# Altium schematic sheet placaOscilador_TP1_ASSD.SchDoc
size A4
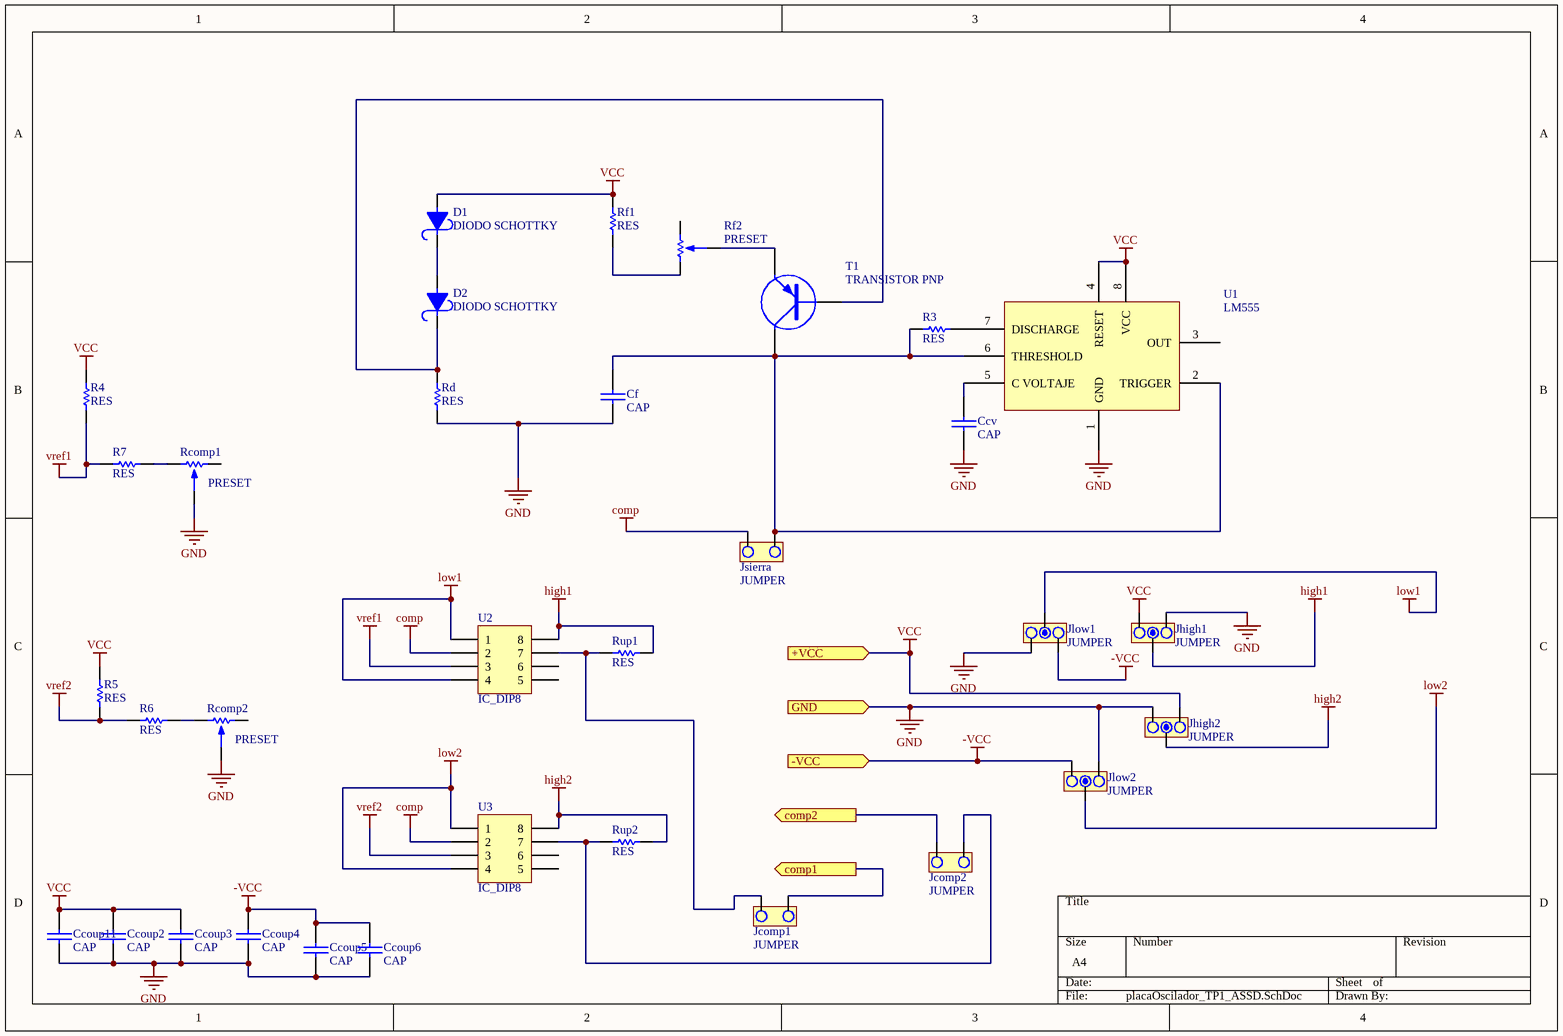
[diagram p0: placaOscilador_TP1_ASSD.SchDoc]

## Parts
Ccoup2  CAP  [CAP200]
Ccoup3  CAP  [CAP200]
Ccoup4  CAP  [CAP200]
Ccoup5  CAP  [CAP200]
Ccoup6  CAP  [CAP200]
Ccoup11  CAP  [CAP200]
Ccv  CAP  [CAP200]
Cf  CAP  [CAP200]
D1  DIODO SCHOTTKY  [DO41]
D2  DIODO SCHOTTKY  [DO41]
Jcomp1  JUMPER  [JUMPER2]
Jcomp2  JUMPER  [JUMPER2]
Jhigh1  JUMPER  [JUMPER3]
Jhigh2  JUMPER  [JUMPER3]
Jlow1  JUMPER  [JUMPER3]
Jlow2  JUMPER  [JUMPER3]
Jsierra  JUMPER  [JUMPER2]
R3  RES  [RES300]
R4  RES  [RES300]
R5  RES  [RES300]
R6  RES  [RES300]
R7  RES  [RES300]
Rcomp1  PRESET  [PRESET V]
Rcomp2  PRESET  [PRESET V]
Rd  RES  [RES300]
Rf1  RES  [RES300]
Rf2  PRESET  [PRESET V]
Rup1  RES  [RES300]
Rup2  RES  [RES300]
T1  TRANSISTOR PNP  [TO92]
U1  LM555  [DIP8]
U2  IC_DIP8  [DIP8]
U3  IC_DIP8  [DIP8]

## Ports
+VCC (in), -VCC (in), comp1 (out), comp2 (out), GND (in)

## Nets
-VCC: Ccoup4.1 Ccoup5.1 Ccoup6.1 Jlow1.1 Jlow2.1 ; port -VCC
comp: Jsierra.1 U2.2 U3.2
GND: Ccoup2.2 Ccoup3.2 Ccoup4.2 Ccoup5.2 Ccoup6.2 Ccoup11.2 Ccv.2 Cf.2 Jhigh1.3 Jhigh2.1 Jlow1.3 Jlow2.3 Rcomp1.2 Rcomp2.2 Rd.1 U1.1(GND) ; port GND
high1: Jhigh1.2 Rup1.2 U2.8
high2: Jhigh2.2 Rup2.2 U3.8
low1: Jlow1.2 U2.1 U2.4
low2: Jlow2.2 U3.1 U3.4
VCC: Ccoup2.1 Ccoup3.1 Ccoup11.1 D1.1 Jhigh1.1 Jhigh2.3 R4.2 R5.2 Rf1.2 U1.4(RESET) U1.8(VCC) ; port +VCC
vref1: R4.1 R7.1 U2.3
vref2: R5.1 R6.1 U3.3
comp1: Jcomp1.2 ; port comp1
comp2: Jcomp2.1 ; port comp2
NetCcv_1: Ccv.1 U1.5(C_VOLTAJE)
NetCf_1: Cf.1 Jsierra.2 R3.1 T1.2(C) U1.2(TRIGGER) U1.6(THRESHOLD)
NetD1_2: D1.2 D2.1
NetD2_2: D2.2 Rd.2 T1.1(B)
NetJcomp1_1: Jcomp1.1 Rup1.1 U2.7
NetJcomp2_2: Jcomp2.2 Rup2.1 U3.7
NetR3_2: R3.2 U1.7(DISCHARGE)
NetR6_2: R6.2 Rcomp2.3
NetR7_2: R7.2 Rcomp1.3
NetRf1_1: Rf1.1 Rf2.3
NetRf2_2: Rf2.2 T1.3(E)

Not connected (* = marked no-connect by the designer): Rcomp1 1; Rcomp2 1; Rf2 1; U1 3(OUT); U2 5 6; U3 5 6

## Library data of the parts
Jhigh1 Jhigh2 Jlow1 Jlow2 = JUMPER3
U1 = LM555: Timer